# EAGLE design Striptease-Teensy4.0-v1.2 (EAGLE 9.6.2)
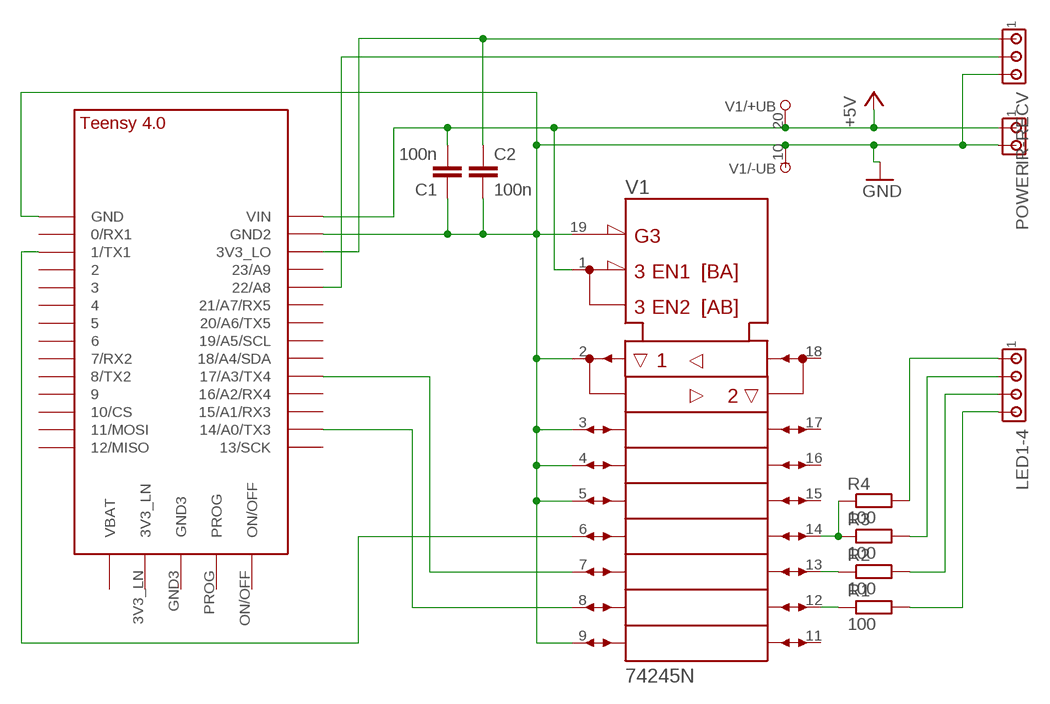
[diagram p0: schematic, sheet 1]

## Parts
C1  100n  C-EU050-025X075  [C050-025X075]
C2  100n  C-EU050-025X075  [C050-025X075]
IR-RECV  MTA03-100  [10X03MTA]
LED1-4  MTA04-100  [10X04MTA]
POWER  MTA02-100  [10X02MTA]
R1  100  R-EU_0207/10  [0207/10]
R2  100  R-EU_0207/10  [0207/10]
R3  100  R-EU_0207/10  [0207/10]
R4  100  R-EU_0207/10  [0207/10]
U$1  TEENSY_4.0-BASIC  [TEENSY_4.0-BASIC]
V1  74245N  [DIL20]

## Nets
+5V: C1.2 POWER.1 U$1.VIN V1.1(DIR) V1.20(+UB)
GND: C1.1 C2.2 IR-RECV.3 POWER.2 U$1.GND U$1.GND2 V1.2(A1) V1.3(A2) V1.4(A3) V1.5(A4) V1.9(A8) V1.10(-UB) V1.19(!G)
N$1: IR-RECV.2 U$1.22/A8
N$2: C2.1 IR-RECV.1 U$1.3V3_LO
N$5: LED1-4.1 R4.2
N$7: LED1-4.2 R3.2
N$8: LED1-4.3 R2.2
N$9: LED1-4.4 R1.2
N$10: U$1.14/A0(14/A0/TX3) V1.8(A7)
N$11: R1.1 V1.12(B7)
N$12: R2.1 V1.13(B6)
N$13: R3.1 R4.1 V1.14(B5)
N$14: U$1.17/A3(17/A3/TX4) V1.7(A6)
N$21: U$1.1/TX(1/TX1) V1.6(A5)
Unconnected: U$1.0/RX(0/RX1) U$1.2 U$1.3/CANTX U$1.3V3_LN U$1.4/CANRX U$1.5 U$1.6 U$1.7(7/RX2) U$1.8(8/TX2) U$1.9/CS U$1.10/CS U$1.11/MOSI U$1.12/MISO U$1.13/SCK U$1.15/A1(15/A1/RX3) U$1.16/A2(16/A2/RX4) U$1.18/A4/SDA U$1.19/A5/SCL U$1.20/A6(20/A6/TX5) U$1.21/A7(21/A7/RX5) U$1.23/A9 U$1.GND3 U$1.ON/OFF U$1.PROG U$1.VBAT\(VBAT) V1.11(B8) V1.15(B4) V1.16(B3) V1.17(B2) V1.18(B1)

## Library data of the parts
C1 C2 = rcl:C-EU: CAPACITOR, European symbol; SPICEPREFIX: C
IR-RECV = con-amp:MTA03-100: AMP connector
LED1-4 = con-amp:MTA04-100: AMP connector
POWER = con-amp:MTA02-100: AMP connector
R1-R4 = rcl:R-EU_: RESISTOR, European symbol; SPICEPREFIX: R
U$1 = Teensy-4.0:TEENSY_4.0-BASIC
V1 = 74ttl-din:74*245: Octal BUS TRANSCEIVER, 3-state

## Board
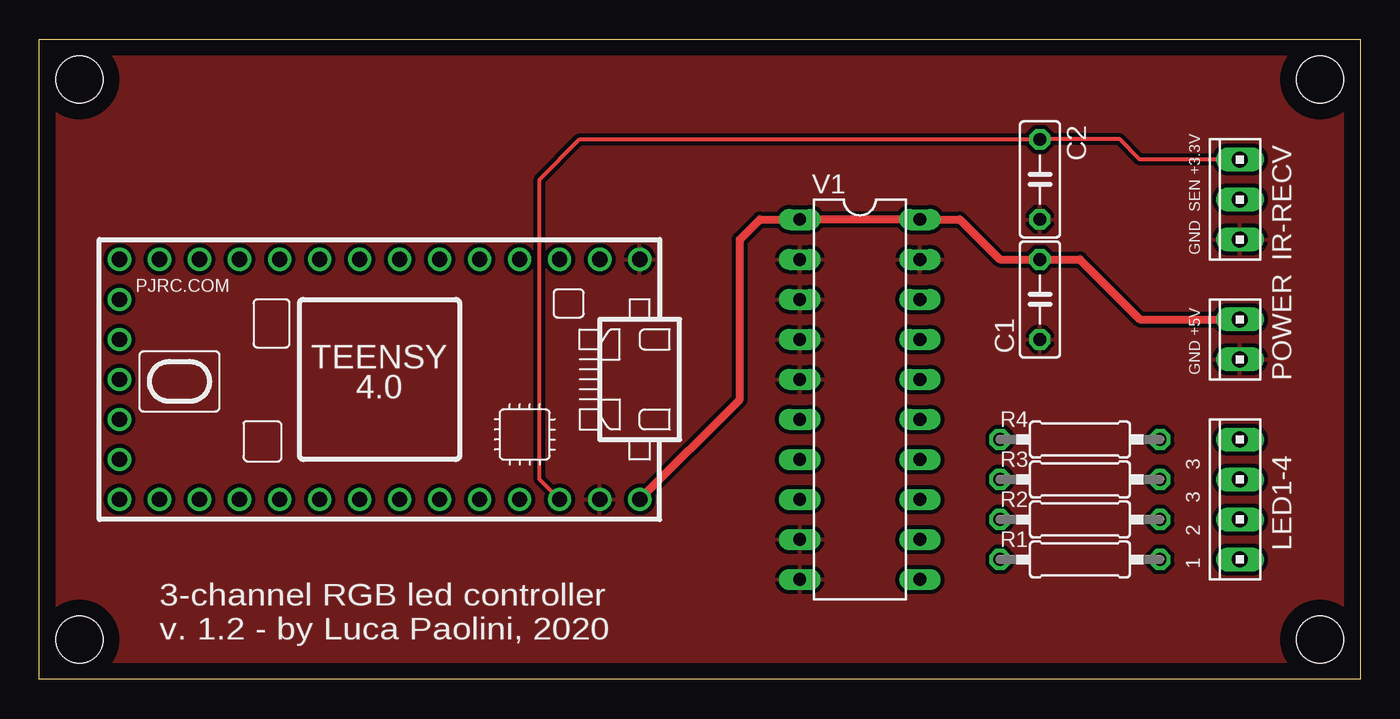
[diagram p1: board, top side]
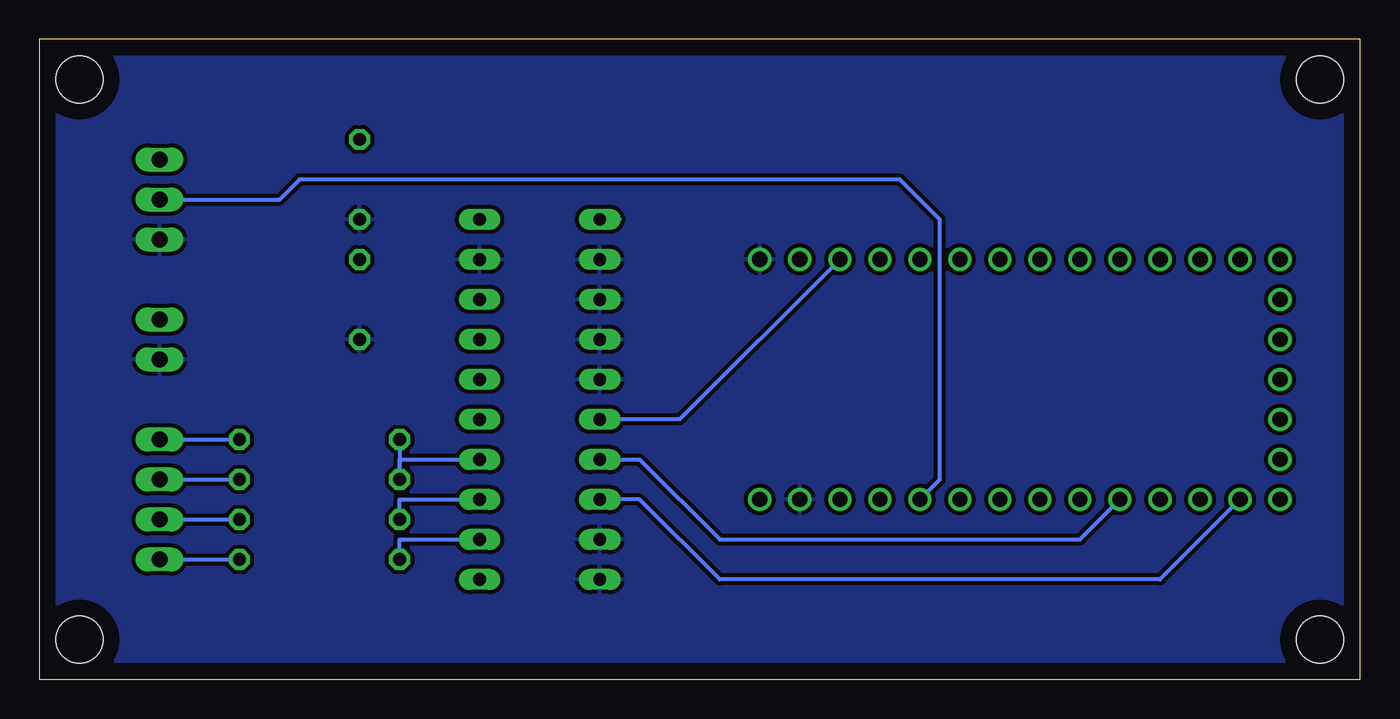
[diagram p2: board, bottom side, seen from below]

Size 83.82 x 40.64 mm. Coordinates in mm from the lower left corner, seen from the top.
Outline: 0,40.64 83.82,40.64 83.82,0 0,0 0,40.64
Copper layers (1*16): Top 0.035mm / dielectric 1.5mm / Bottom 0.035mm
Design rules "default *": minimum track width 6mil, minimum drill 0.35mm, track to track 10mil, track to pad 10mil, pad to pad 10mil, via to via 10mil, smd to smd 6mil, copper to edge 40mil, drill to drill 6mil, minimum pad ring 10mil, minimum via ring 8mil, stop-mask expansion 4mil, vias tented up to drill 0mil, thermal gap 10mil
Holes 3 mm at 2.54,38.1 81.28,38.1 81.28,2.54 2.54,2.54

### Footprints (pad centres in the part's own frame; a part is rotated, then mirrored left to right if it is on the bottom)
C050-025X075 = drill 0.813 octagon: 1 -2.54,0; 2 2.54,0
10X03MTA = drill 1.016 long: 1 2.54,0; 2 0,0; 3 -2.54,0
10X04MTA = drill 1.016 long: 1 3.81,0; 2 1.27,0; 3 -1.27,0; 4 -3.81,0
10X02MTA = drill 1.016 long: 1 1.27,0; 2 -1.27,0
0207/10 = drill 0.813 octagon: 1 -5.08,0; 2 5.08,0
TEENSY_4.0-BASIC = drill 0.965: 0/RX -13.97,-7.62; 1/TX -11.43,-7.62; 2 -8.89,-7.62; 3/CANTX -6.35,-7.62; 3V3_LN 16.51,-2.54; 3V3_LO -11.43,7.62; 4/CANRX -3.81,-7.62; 5 -1.27,-7.62; 6 1.27,-7.62; 7 3.81,-7.62; 8 6.35,-7.62; 9/CS 8.89,-7.62; 10/CS 11.43,-7.62; 11/MOSI 13.97,-7.62; 12/MISO 16.51,-7.62; 13/SCK 16.51,7.62; 14/A0 13.97,7.62; 15/A1 11.43,7.62; 16/A2 8.89,7.62; 17/A3 6.35,7.62; 18/A4/SDA 3.81,7.62; 19/A5/SCL 1.27,7.62; 20/A6 -1.27,7.62; 21/A7 -3.81,7.62; 22/A8 -6.35,7.62; 23/A9 -8.89,7.62; GND -16.51,-7.62; GND2 -13.97,7.62; GND3 16.51,0; ON/OFF 16.51,5.08; PROG 16.51,2.54; VBAT\ 16.51,-5.08; VIN -16.51,7.62
DIL20 = drill 0.813 long: 1 -11.43,-3.81; 2 -8.89,-3.81; 3 -6.35,-3.81; 4 -3.81,-3.81; 5 -1.27,-3.81; 6 1.27,-3.81; 7 3.81,-3.81; 8 6.35,-3.81; 9 8.89,-3.81; 10 11.43,-3.81; 11 11.43,3.81; 12 8.89,3.81; 13 6.35,3.81; 14 3.81,3.81; 15 1.27,3.81; 16 -1.27,3.81; 17 -3.81,3.81; 18 -6.35,3.81; 19 -8.89,3.81; 20 -11.43,3.81

### Placement (x,y rotation side)
C1  63.5,24.13 90 top
C2  63.5,31.75 270 top
IR-RECV  76.2,30.48 90 top
LED1-4  76.2,11.43 90 top
POWER  76.2,21.59 90 top
R1  66.04,7.62 0 top
R2  66.04,10.16 0 top
R3  66.04,12.7 0 top
R4  66.04,15.24 0 top
U$1  21.59,19.05 180 top
V1  52.07,17.78 270 top

### Tracks (layer width: path | path; a pad name or v marks a point on that pad's centre or on a via)
+5V
  Top 0.508: U$1.VIN 44.45,17.78 44.45,27.94 45.72,29.21 V1.1 V1.20 58.42,29.21 60.96,26.67 C1.2 66.04,26.67 69.85,22.86 POWER.1
  Bottom 0.254: 46.99,29.21 V1.1
GND
  pour Bottom: 0,40.64 83.82,40.64 83.82,0 0,0
  pour Top: 0,40.64 83.82,40.64 83.82,0 0,0
N$1
  Bottom 0.254: IR-RECV.2 68.58,30.48 67.31,31.75 29.21,31.75 26.67,29.21 26.67,12.7 U$1.22/A8
N$2
  Top 0.254: IR-RECV.1 69.85,33.02 68.58,34.29 C2.1 34.29,34.29 31.75,31.75 31.75,12.7 U$1.3V3_LO
N$5
  Bottom 0.254: LED1-4.1 R4.2
N$7
  Bottom 0.254: LED1-4.2 R3.2
N$8
  Bottom 0.254: LED1-4.3 R2.2
N$9
  Bottom 0.254: LED1-4.4 R1.2
N$10
  Bottom 0.254: U$1.14/A0 12.7,6.35 40.64,6.35 45.72,11.43 V1.8
N$11
  Bottom 0.254: R1.1 60.96,8.89 V1.12
N$12
  Bottom 0.254: R2.1 60.96,11.43 V1.13
N$13
  Bottom 0.254: V1.14 60.96,13.97 R3.1 R4.1
N$14
  Bottom 0.254: V1.7 45.72,13.97 40.64,8.89 17.78,8.89 U$1.17/A3
N$21
  Bottom 0.254: 46.99,16.51 V1.6 43.18,16.51 U$1.1/TX

### Text on the board
tNames: GND SEN +3.3V | GND +5V | 1 2 3 3 | 3-channel RGB led controller / v. 1.2 - by Luca Paolini, 2020